# EAGLE schematic max32-template (EAGLE 5.10)
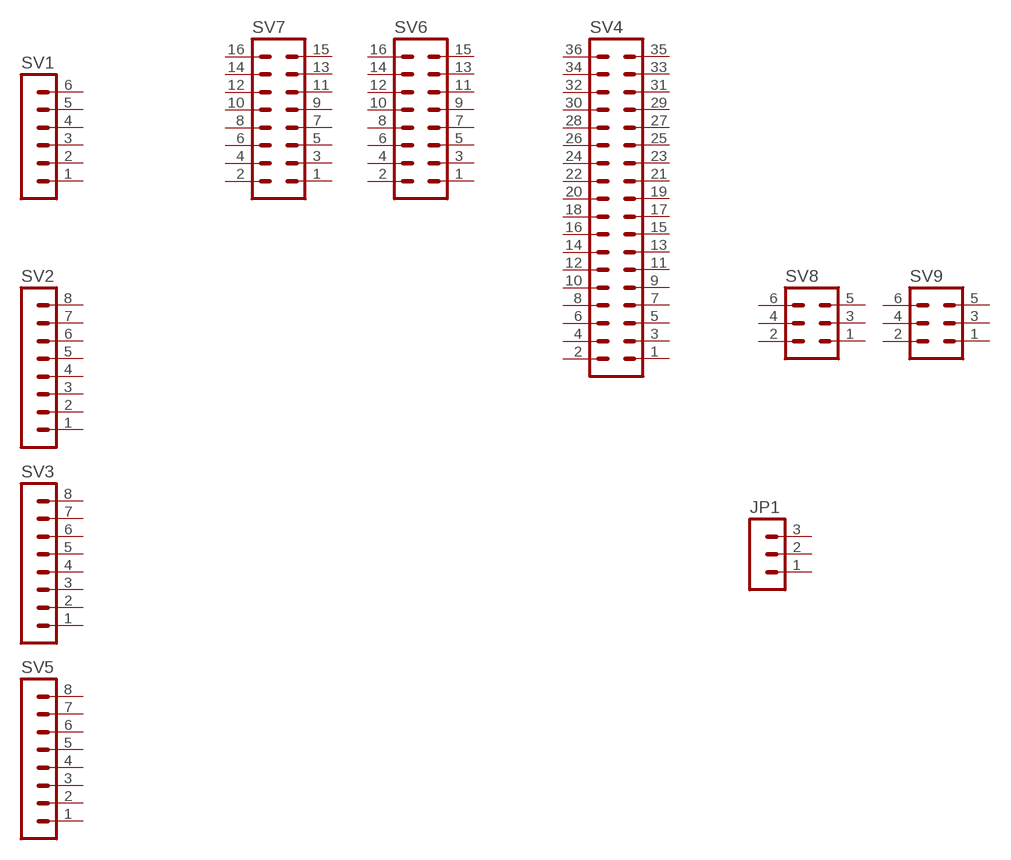
[diagram p0: schematic, sheet 1]

## Parts
JP1  MA03-1  [MA03-1]
SV1  MA06-1  [MA06-1]
SV2  MA08-1  [MA08-1]
SV3  MA08-1  [MA08-1]
SV4  MA18-2  [MA18-2]
SV5  MA08-1  [MA08-1]
SV6  MA08-2  [MA08-2]
SV7  MA08-2  [MA08-2]
SV8  MA03-2  [MA03-2]
SV9  MA03-2  [MA03-2]
Unconnected: JP1.1 JP1.2 JP1.3 SV1.1 SV1.2 SV1.3 SV1.4 SV1.5 SV1.6 SV2.1 SV2.2 SV2.3 SV2.4 SV2.5 SV2.6 SV2.7 SV2.8 SV3.1 SV3.2 SV3.3 SV3.4 SV3.5 SV3.6 SV3.7 SV3.8 SV4.1 SV4.2 SV4.3 SV4.4 SV4.5 SV4.6 SV4.7 SV4.8 SV4.9 SV4.10 SV4.11 SV4.12 SV4.13 SV4.14 SV4.15 SV4.16 SV4.17 SV4.18 SV4.19 SV4.20 SV4.21 SV4.22 SV4.23 SV4.24 SV4.25 SV4.26 SV4.27 SV4.28 SV4.29 SV4.30 SV4.31 SV4.32 SV4.33 SV4.34 SV4.35 SV4.36 SV5.1 SV5.2 SV5.3 SV5.4 SV5.5 SV5.6 SV5.7 SV5.8 SV6.1 SV6.2 SV6.3 SV6.4 SV6.5 SV6.6 SV6.7 SV6.8 SV6.9 SV6.10 SV6.11 SV6.12 SV6.13 SV6.14 SV6.15 SV6.16 SV7.1 SV7.2 SV7.3 SV7.4 SV7.5 SV7.6 SV7.7 SV7.8 SV7.9 SV7.10 SV7.11 SV7.12 SV7.13 SV7.14 SV7.15 SV7.16 SV8.1 SV8.2 SV8.3 SV8.4 SV8.5 SV8.6 SV9.1 SV9.2 SV9.3 SV9.4 SV9.5 SV9.6

## Library data of the parts
JP1 = con-lstb:MA03-1: PIN HEADER
SV1 = con-lstb:MA06-1: PIN HEADER
SV2 SV3 SV5 = con-lstb:MA08-1: PIN HEADER
SV4 = con-lstb:MA18-2: PIN HEADER
SV6 SV7 = con-lstb:MA08-2: PIN HEADER
SV8 SV9 = con-lstb:MA03-2: PIN HEADER